# EAGLE design pipowerrealy (EAGLE 8.7.0)
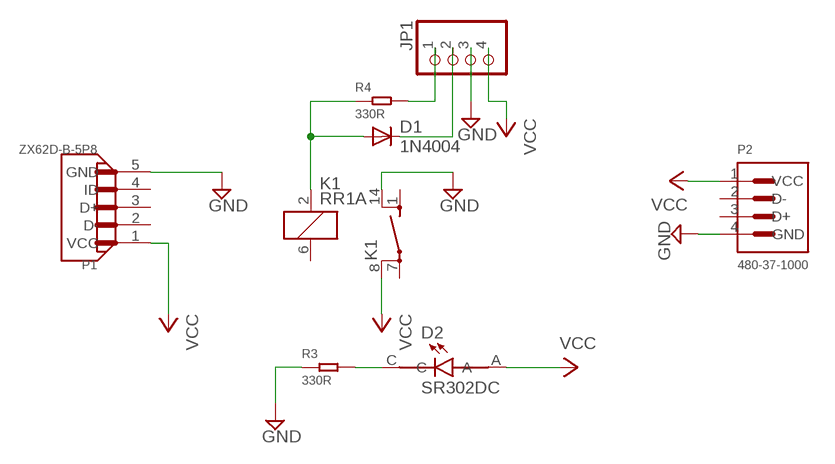
[diagram p0: schematic, sheet 1]

## Parts
D1  1N4004  [DO41-10]
D2  SR302DC  [LED_SR302DC]
JP1  PINHD-1X4  [1X04]
K1  RR1A  [RR1A]
P1  ZX62D-B-5P8  [HRS_ZX62D-B-5P8]
P2  480-37-1000  [MOLEX_480-37-1000]
R3  330R  DIP-RES-330R-5%-1/4W(PR-D2.3XL6.5MM)  [PR-D2.3XL6.5MM]
R4  330R  DIP-RES-330R-5%-1/4W(PR-D2.3XL6.5MM)  [PR-D2.3XL6.5MM]

## Nets
GND: JP1.3 K1.14(2:S) P1.5(GND) P2.4(GND) R3.1
N$1: D2.C R3.2
N$2: D1.C JP1.2
N$4: JP1.1 R4.2
N$6: D1.A K1.2 R4.1
VCC: D2.A JP1.4 K1.8(2:P) P1.1(VCC) P2.1(VCC)
Unconnected: K1.1(2:S) K1.6 K1.7(2:P) P1.2(D-) P1.3(D+) P1.4(ID) P2.2(D-) P2.3(D+)

## Library data of the parts
D1 = diode:1N4004: DIODE general purpose rectifier, 1 A
D2 = Common-Parts-Library-Eagle:SR302DC: DIP LED Red-Red; MANUFACTURER: Chengguangxing
JP1 = pinhead:PINHD-1X4: PIN HEADER
K1 = relay:RR1A: RELAY reed, polarity, 1 x norm. open with shield; OC_FARNELL: unknown; OC_NEWARK: unknown
P1 = Common-Parts-Library-Eagle:ZX62D-B-5P8: Conn Micro USB 2.0 Type B RCP 5 POS 0.65mm Solder RA SMD 5 Terminal 1 Port Embossed T/R; MANUFACTURER: Hirose
P2 = Common-Parts-Library-Eagle:480-37-1000: Conn.; Data; USB; Plug; Shielded; Type A; Rt Angle; SMT; PCB Thickness 1.20mm-1.60mm; MANUFACTURER: Molex
R3 R4 = Seeed-Resistor:DIP-RES-330R-5%-1/4W(PR-D2.3XL6.5MM): 301020003; MPN: FHCFR-1/4W-331J

## Board
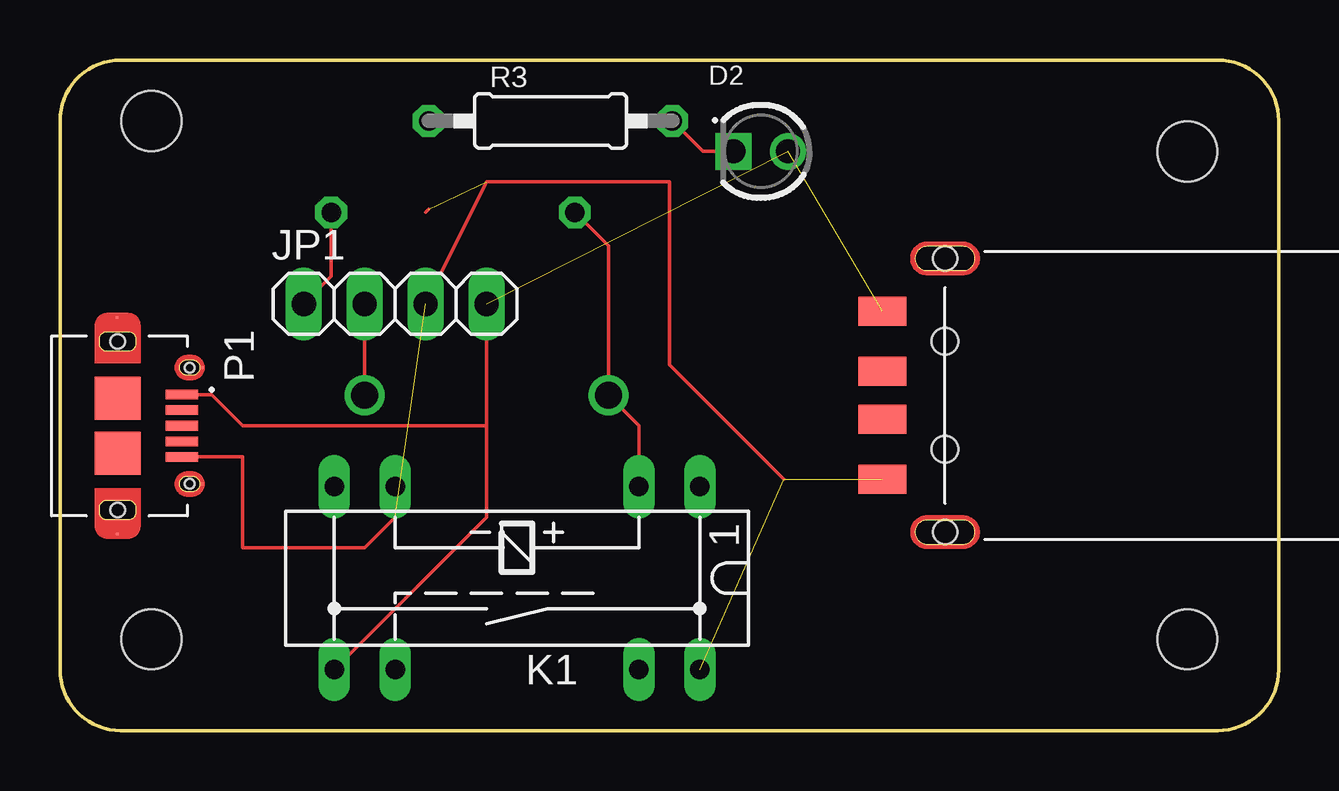
[diagram p1: board, top side]
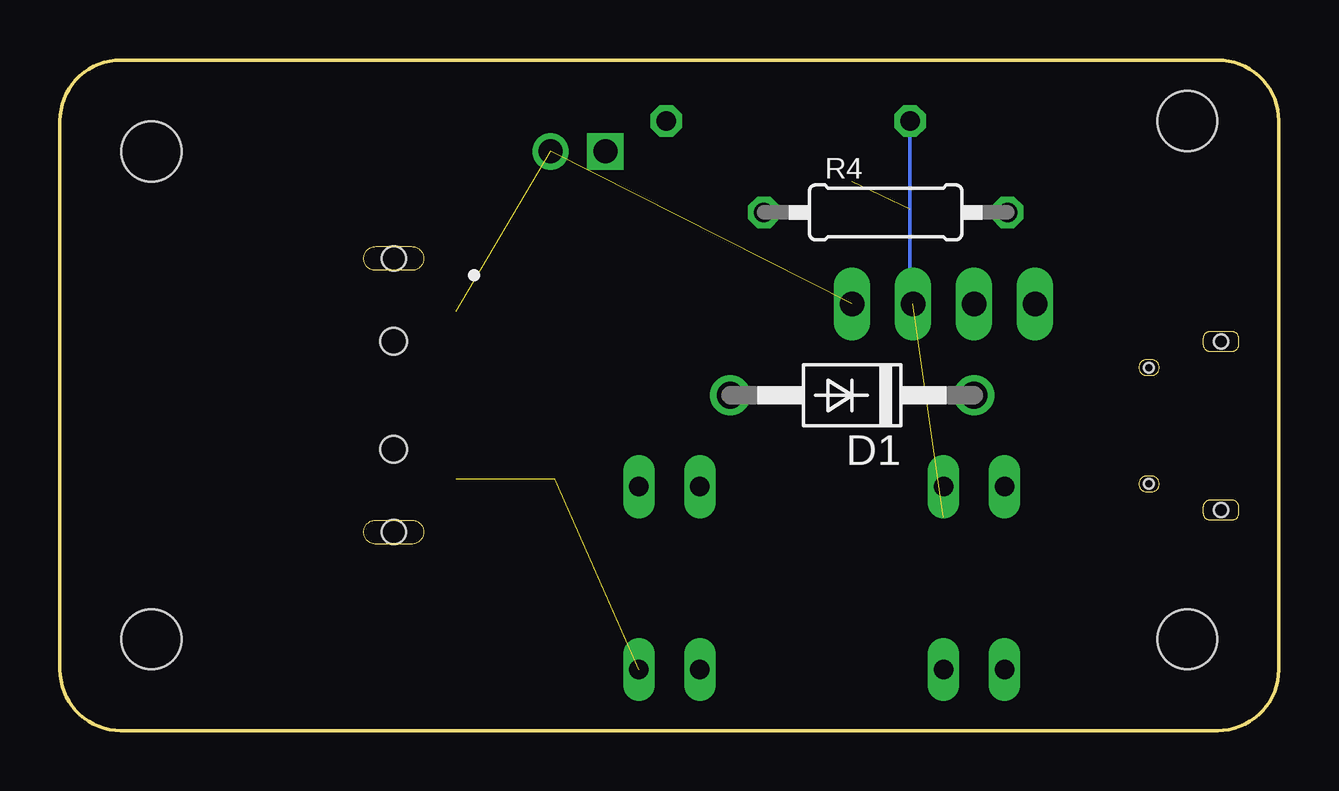
[diagram p2: board, bottom side, seen from below]

Size 50.8 x 27.94 mm. Coordinates in mm from the lower left corner, seen from the top.
Outline: 2.54,27.94 48.26,27.94 arc-90 50.8,25.4 50.8,2.54 arc-90 48.26,0 2.54,0 arc-90 0,2.54 0,25.4 arc-90 2.54,27.94
Copper layers (1*16): Top 0.035mm / dielectric 1.5mm / Bottom 0.035mm
Design rules "default": minimum track width 6mil, minimum drill 0.35mm, track to track 6mil, track to pad 6mil, pad to pad 6mil, via to via 6mil, smd to smd 6mil, copper to edge 40mil, drill to drill 6mil, minimum pad ring 10mil, minimum via ring 8mil, stop-mask expansion 4mil, vias tented up to drill 0mil, thermal gap 10mil
Holes 2.49 mm at 46.99,24.13 46.99,3.81 3.81,25.4 3.81,3.81

### Footprints (pad centres in the part's own frame; a part is rotated, then mirrored left to right if it is on the bottom)
DO41-10 = drill 1.118: A 5.08,0; C -5.08,0
LED_SR302DC = drill 1: A 1.14,0 | drill 1 square: C -1.14,0
1X04 = drill 1.016 long: 1 -3.81,0; 2 -1.27,0; 3 1.27,0; 4 3.81,0
RR1A = drill 0.813 long: 1 -7.62,-3.81; 2 -5.08,-3.81; 6 5.08,-3.81; 7 7.62,-3.81; 8 7.62,3.81; 9 5.08,3.81; 13 -5.08,3.81; 14 -7.62,3.81
HRS_ZX62D-B-5P8 = smd 0.4 x 1.35: 1 -1.3,0; 2 -0.65,0; 3 0,0; 4 0.65,0; 5 1.3,0 | smd 0.1 x 0.1: P1 -2.425,0.85; P2 2.425,0.838; P3 -4.513,-2.712; P6 4.513,-2.688 | smd 1.8 x 1.9: P4 -1.15,-2.675; P5 1.15,-2.675 | hole 0.4: -2.425,0.325; 2.425,0.325 | hole 0.6: -3.513,-2.675; 3.513,-2.675
MOLEX_480-37-1000 = smd 1.2 x 2: 1 -3.5,0; 2 -1,0; 3 1,0; 4 3.5,0 | hole 1.1: -2.25,2.6; 2.25,2.6 | hole 1: -5.7,2.6; 5.7,2.6
PR-D2.3XL6.5MM = drill 0.813 octagon: 1 -4.953,0; 2 5.207,0

### Placement (x,y rotation side)
D1  17.78,13.97 180 bottom
D2  29.21,24.13 0 top
JP1  13.97,17.78 0 top
K1  19.05,6.35 180 top
P1  5.08,12.7 270 top
P2  34.29,13.97 270 top
R3  20.32,25.4 0 top
R4  16.51,21.59 0 bottom

### Tracks (layer width: path | path; a pad name or v marks a point on that pad's centre or on a via)
GND  (4 unrouted)
  Top 0.152: 15.37,21.72 15.24,21.59 | 15.24,25.27 R3.1 | JP1.3 17.78,22.86 25.4,22.86 25.4,15.24 30.17,10.47 | 13.97,8.89 12.7,7.62 7.62,7.62 7.62,11.4 P1.5
  Bottom 0.152: JP1.3 15.37,17.91 R3.1
N$1
  Top 0.152: R3.2 26.8,24.13 D2.C
N$2
  Top 0.152: JP1.2 D1.C
N$4
  Top 0.152: R4.2 11.3,18.92 JP1.1
N$6
  Top 0.152: R4.1 22.86,20.19 D1.A 24.13,12.7 K1.2
VCC  (2 unrouted)
  Top 0.152: K1.8 17.78,8.89 17.78,12.7 | 17.78,12.7 JP1.4 | 17.78,12.7 7.62,12.7 6.32,14 P1.1